# EAGLE schematic adc (EAGLE 9.6.2)
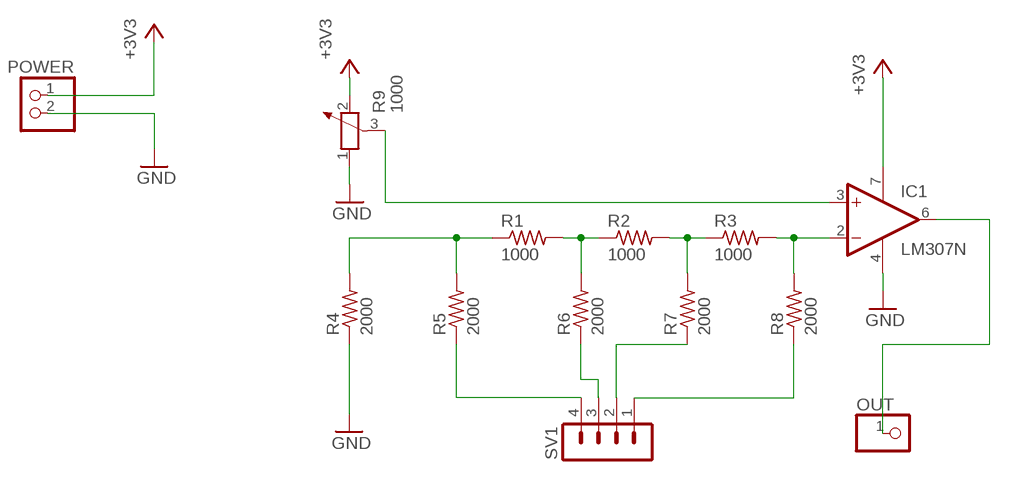
[diagram p0: schematic, sheet 1]

## Parts
IC1  LM307N  [DIL08]
OUT  PINHD-1X1  [1X01]
POWER  PINHD-1X2  [1X02]
R1  1000  R-US_0204/7  [0204/7]
R2  1000  R-US_0204/7  [0204/7]
R3  1000  R-US_0204/7  [0204/7]
R4  2000  R-US_0204/7  [0204/7]
R5  2000  R-US_0204/7  [0204/7]
R6  2000  R-US_0204/7  [0204/7]
R7  2000  R-US_0204/7  [0204/7]
R8  2000  R-US_0204/7  [0204/7]
R9  1000  POTENTIOMETER_PT-10  [PT-10]
SV1  MA04-1  [MA04-1]

## Nets
+3V3: IC1.7(V+) POWER.1 R9.2
GND: IC1.4(V-) POWER.2 R4.1 R9.1
N$1: R1.1 R4.2 R5.2
N$2: R1.2 R2.1 R6.2
N$3: R2.2 R3.1 R7.2
N$4: IC1.2(-IN) R3.2 R8.2
N$5: R5.1 SV1.4
N$6: R6.1 SV1.3
N$7: R7.1 SV1.2
N$8: R8.1 SV1.1
N$9: IC1.3(+IN) R9.3
N$10: IC1.6(OUT) OUT.1

## Library data of the parts
IC1 = linear:LM307: OP AMP
OUT = pinhead:PINHD-1X1: PIN HEADER
POWER = pinhead:PINHD-1X2: PIN HEADER
R1-R8 = rcl:R-US_: RESISTOR, American symbol; SPICEPREFIX: R
R9 = rcl:POTENTIOMETER_: Potentiometer; SPICEMODEL: POT; SPICEPREFIX: X
SV1 = con-lstb:MA04-1: PIN HEADER; OC_FARNELL: unknown; OC_NEWARK: unknown